# EAGLE design USBug (EAGLE 6.1)
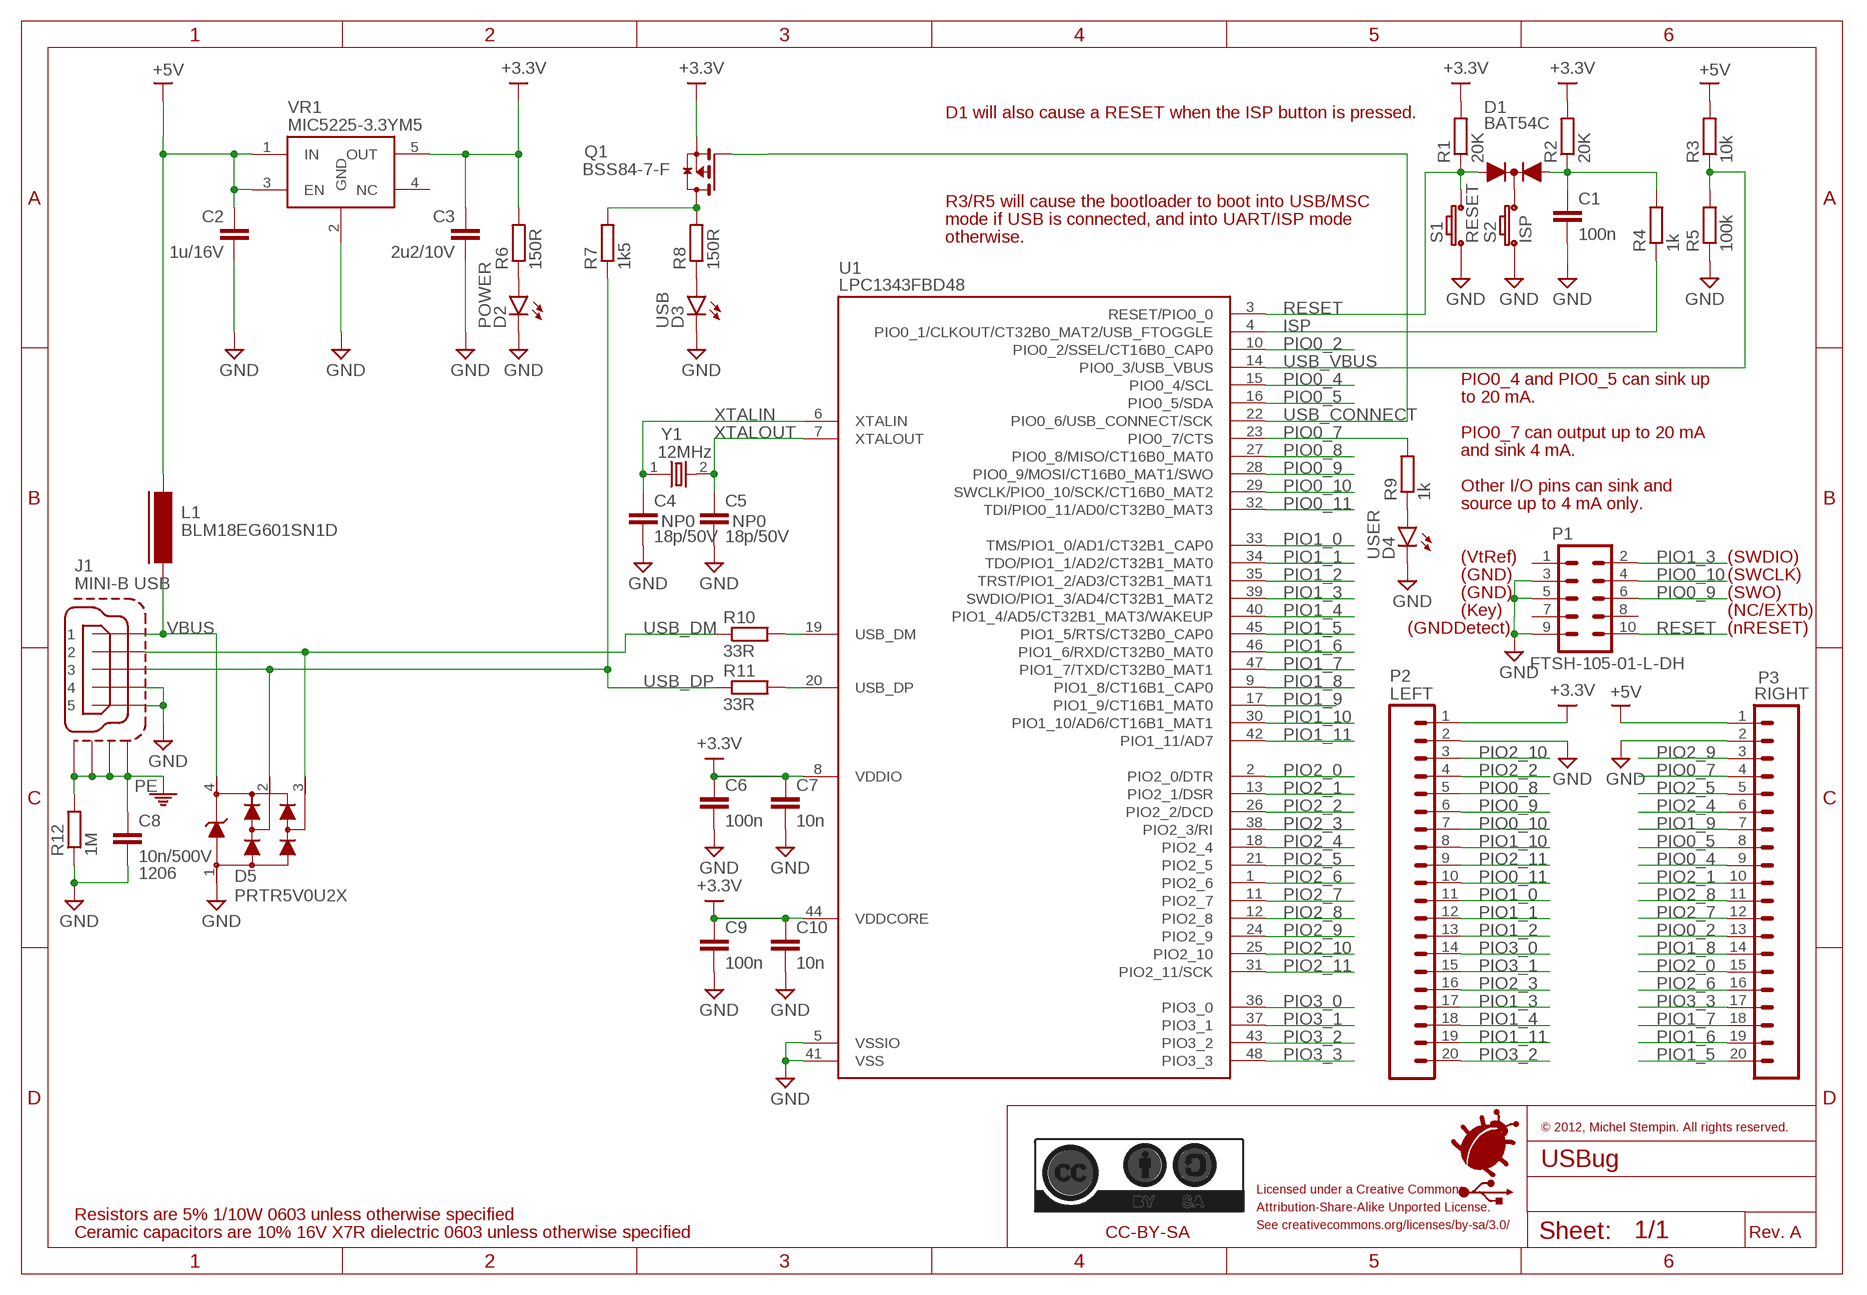
[diagram p0: schematic, sheet 1]

## Parts
C1  100n  CAP_0603  [CAP_0603]
C2  1u/16V  CAP_0603  [CAP_0603]
C3  2u2/10V  CAP_0603  [CAP_0603]
C4  18p/50V  CAP_0603  [CAP_0603]
C5  18p/50V  CAP_0603  [CAP_0603]
C6  100n  CAP_0603  [CAP_0603]
C7  10n  CAP_0603  [CAP_0603]
C8  10n/500V  CAP_1206  [CAP_1206]
C9  100n  CAP_0603  [CAP_0603]
C10  10n  CAP_0603  [CAP_0603]
D1  BAT54C  [SOT23-R]
D2  POWER  LED_0805  [LED_0805]
D3  USB  LED_0805  [LED_0805]
D4  USER  LED_0805  [LED_0805]
D5  PRTR5V0U2X  [SOT143B]
J1  MINI-B USB  MINI-B_USBUX60-MB-5ST  [UX60-MB-5ST]
L1  BLM18EG601SN1D  FERRITE_BEAD0603  [FB_0603]
LOGO  USBUG  [USBUG]
P1  FTSH-105-01-L-DH  [FTSH-105-01-L-DH]
P2  LEFT  HEADER_1X20_LOCK  [SPARKFUN_1X20_LOCK]
P3  RIGHT  HEADER_1X20_LOCK  [SPARKFUN_1X20_LOCK]
Q1  BSS84-7-F  [SOT23-R]
R1  20K  RES_0603  [RES_0603]
R2  20K  RES_0603  [RES_0603]
R3  10k  RES_0603  [RES_0603]
R4  1k  RES_0603  [RES_0603]
R5  100k  RES_0603  [RES_0603]
R6  150R  RES_0603  [RES_0603]
R7  1k5  RES_0603  [RES_0603]
R8  150R  RES_0603  [RES_0603]
R9  1k  RES_0603  [RES_0603]
R10  33R  RES_0603  [RES_0603]
R11  33R  RES_0603  [RES_0603]
R12  1M  RES_0603  [RES_0603]
S1  RESET  SPST_SWITCH  [ADTSM3]
S2  ISP  SPST_SWITCH  [ADTSM3]
U1  LPC1343FBD48  [LQFP48]
VR1  MIC5225-3.3YM5  [SOT23-5]
Y1  12MHz  CRYSTAL_50X32  [NX5032GA]

## Nets
+3.3V: C3.1 C6.1 C7.1 C9.1 C10.1 P2.1 Q1.2(S) R1.2 R2.2 R6.2 U1.8(VDDIO) U1.44(VDDCORE) VR1.5(OUT)
+5V: C2.1 L1.1 P3.1 R3.2 VR1.1(IN) VR1.3(EN)
GND: C1.2 C2.2 C3.2 C4.2 C5.2 C6.2 C7.2 C8.2 C9.2 C10.2 D2.C D3.C D4.C D5.1 J1.4 J1.5 P1.3 P1.5 P1.9 P2.2 P3.2 R5.1 R12.1 S1.2 S2.2 U1.5(VSSIO) U1.41(VSS) VR1.2(GND)
ISP: R4.1 U1.4(PIO0_1/CLKOUT/CT32B0_MAT2/USB_FTOGGLE)
N$1: D1.3(C) S2.1
N$2: C1.1 D1.2(A2) R2.1 R4.2
N$3: D2.A R6.1
N$4: D4.A R9.1
N$9: D3.A R8.1
N$13: Q1.3(D) R7.2 R8.2
PE: C8.1 J1.M1 J1.M2 J1.M3 J1.M4 R12.2
PIO0_2: P3.13 U1.10(PIO0_2/SSEL/CT16B0_CAP0)
PIO0_4: P3.9 U1.15(PIO0_4/SCL)
PIO0_5: P3.8 U1.16(PIO0_5/SDA)
PIO0_7: P3.4 R9.2 U1.23(PIO0_7/CTS)
PIO0_8: P2.5 U1.27(PIO0_8/MISO/CT16B0_MAT0)
PIO0_9: P1.6 P2.6 U1.28(PIO0_9/MOSI/CT16B0_MAT1/SWO)
PIO0_10: P1.4 P2.7 U1.29(SWCLK/PIO0_10/SCK/CT16B0_MAT2)
PIO0_11: P2.10 U1.32(TDI/PIO0_11/AD0/CT32B0_MAT3)
PIO1_0: P2.11 U1.33(TMS/PIO1_0/AD1/CT32B1_CAP0)
PIO1_1: P2.12 U1.34(TDO/PIO1_1/AD2/CT32B1_MAT0)
PIO1_2: P2.13 U1.35(TRST/PIO1_2/AD3/CT32B1_MAT1)
PIO1_3: P1.2 P2.17 U1.39(SWDIO/PIO1_3/AD4/CT32B1_MAT2)
PIO1_4: P2.18 U1.40(PIO1_4/AD5/CT32B1_MAT3/WAKEUP)
PIO1_5: P3.20 U1.45(PIO1_5/RTS/CT32B0_CAP0)
PIO1_6: P3.19 U1.46(PIO1_6/RXD/CT32B0_MAT0)
PIO1_7: P3.18 U1.47(PIO1_7/TXD/CT32B0_MAT1)
PIO1_8: P3.14 U1.9(PIO1_8/CT16B1_CAP0)
PIO1_9: P3.7 U1.17(PIO1_9/CT16B1_MAT0)
PIO1_10: P2.8 U1.30(PIO1_10/AD6/CT16B1_MAT1)
PIO1_11: P2.19 U1.42(PIO1_11/AD7)
PIO2_0: P3.15 U1.2(PIO2_0/DTR)
PIO2_1: P3.10 U1.13(PIO2_1/DSR)
PIO2_2: P2.4 U1.26(PIO2_2/DCD)
PIO2_3: P2.16 U1.38(PIO2_3/RI)
PIO2_4: P3.6 U1.18(PIO2_4)
PIO2_5: P3.5 U1.21(PIO2_5)
PIO2_6: P3.16 U1.1(PIO2_6)
PIO2_7: P3.12 U1.11(PIO2_7)
PIO2_8: P3.11 U1.12(PIO2_8)
PIO2_9: P3.3 U1.24(PIO2_9)
PIO2_10: P2.3 U1.25(PIO2_10)
PIO2_11: P2.9 U1.31(PIO2_11/SCK)
PIO3_0: P2.14 U1.36(PIO3_0)
PIO3_1: P2.15 U1.37(PIO3_1)
PIO3_2: P2.20 U1.43(PIO3_2)
PIO3_3: P3.17 U1.48(PIO3_3)
RESET: D1.1(A1) P1.10 R1.1 S1.1 U1.3(RESET/PIO0_0)
USB_CONNECT: Q1.1(G) U1.22(PIO0_6/USB_CONNECT/SCK)
USB_DM: D5.3 J1.2 R10.1
USB_DP: D5.2 J1.3 R7.1 R11.1
USB_VBUS: R3.1 R5.2 U1.14(PIO0_3/USB_VBUS)
USBD+: R10.2 U1.19(USB_DM)
USBD-: R11.2 U1.20(USB_DP)
VBUS: D5.4 J1.1 L1.2
XTALIN: C4.1 U1.6(XTALIN) Y1.1
XTALOUT: C5.1 U1.7(XTALOUT) Y1.2
Unconnected: P1.1 P1.7 P1.8 VR1.4(NC)

## Notes on the sheet
- D1 will also cause a RESET when the ISP button is pressed.
- R3/R5 will cause the bootloader to boot into USB/MSC
- mode if USB is connected, and into UART/ISP mode
- otherwise.
- PIO0_4 and PIO0_5 can sink up
- to 20 mA.
- PIO0_7 can output up to 20 mA
- and sink 4 mA.
- Other I/O pins can sink and
- source up to 4 mA only.
- (VtRef) | (SWDIO)
- (GND) | (SWCLK)
- (GND) | (SWO)
- (Key) | (NC/EXTb)
- (GNDDetect) | (nRESET)
- © 2012, Michel Stempin. All rights reserved.
- Licensed under a Creative Commons
- Attribution-Share-Alike Unported License.
- Resistors are 5% 1/10W 0603 unless otherwise specified
- See creativecommons.org/licenses/by-sa/3.0/
- Ceramic capacitors are 10% 16V X7R dielectric 0603 unless otherwise specified | CC-BY-SA | Rev. A

## Library data of the parts
C1-C3 C6 C7 C9 C10 = USBug:CAP
C4 C5 = USBug:CAP; DIELECTRIC: NP0
C8 = USBug:CAP; FOOTPRINT: 1206
D1 = USBug:BAT54C: BAT54C Schottky Diodes (Common Cathode) 30V 200mA, SOT-23 Package Digikey: BAT54CFSCT-ND
D2-D4 = USBug:LED
D5 = USBug:PRTR5V0U2X: Ultra low capacitance double rail-to-rail ESD protection diode
J1 = USBug:MINI-B_USB: MINI USB Connector Source: http://www.hirose.co.jp/cataloge_hp/e24000019.pdf
L1 = USBug:FERRITE_BEAD
LOGO = USBug:USBUG
P1 = USBug:FTSH-105-01-L-DH: Header 10 Position Dual Row 0.5" Pitch Right Angle
P2 P3 = USBug:HEADER_1X20: This is just like the LOCK variant in that the holes are staggared by 5 mil, but except for the last two holes. They are not altered from the "standard" footprint layout. This is used for a special purpose on the layout of our Graphic LCD Backpack. Make sure you want to use this device before selecting it for you project!
Q1 = USBug:BSS84: P-Channel Enhancement Mode Field Effect Transistor Source: http://www.diodes.com/datasheets/ds30149.pdf
R1-R12 = USBug:RES
S1 S2 = USBug:SPST_SWITCH: 3.5 x 6 mm Vertical Tact Switch Source: ADTS3.pdf ADTSM32RVTR 260gf operating force, 5 mm height (Red): [Digikey: 679-2307-1-ND]
U1 = USBug:LPC1343FBD48: LPC1343FBD48 72 MHz 32-bit ARM Cortex-M3 microcontroller. 32 kB Flash, 8 kB SRAM, USB Device in LQFP48 package Mouser: 771-LPC1343FBD48151 <http://www2.mouser.com/search/ProductDetail.aspx?qs=GXxaSVPoQQrV0FOIhs3F%252bQ%3d%3d> Digikey: 568-4945-ND <http://search.digikey.com/us/en/products/LPC1343FBD48,151/568-4945-ND/2180456>
VR1 = USBug:MIC5225: Ultra-Low Quiescent Current 150mA µCap Low Dropout Regulator; VOLTAGE: 3.3V
Y1 = USBug:CRYSTAL

## Board
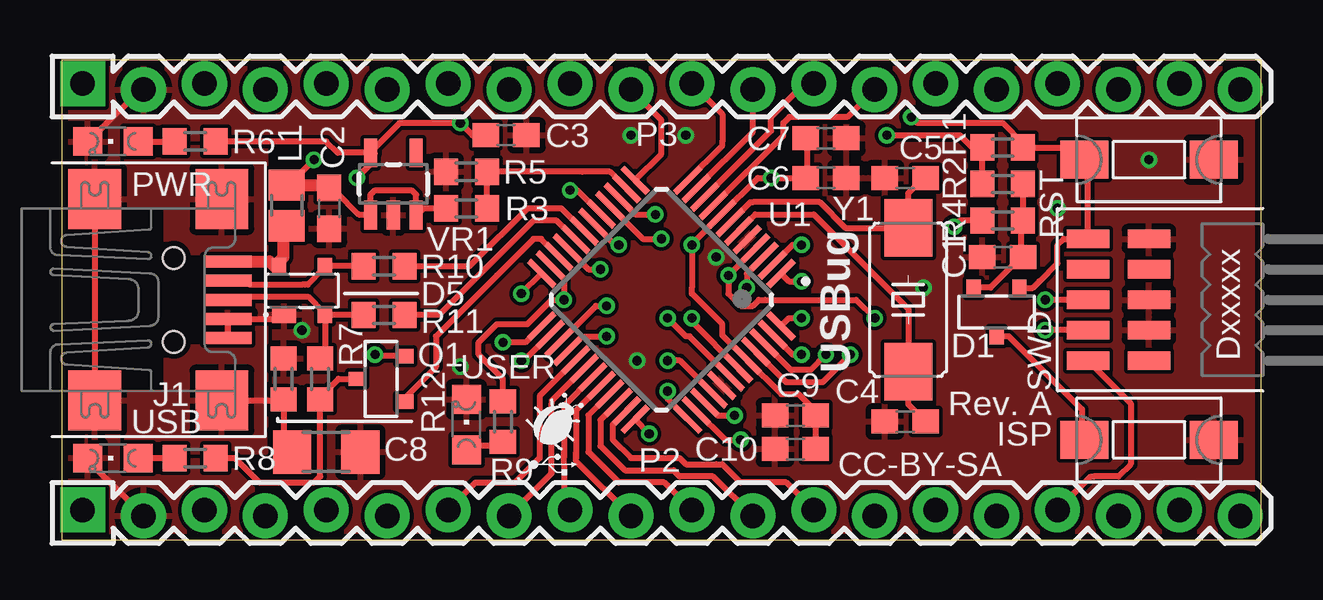
[diagram p1: board, top side]
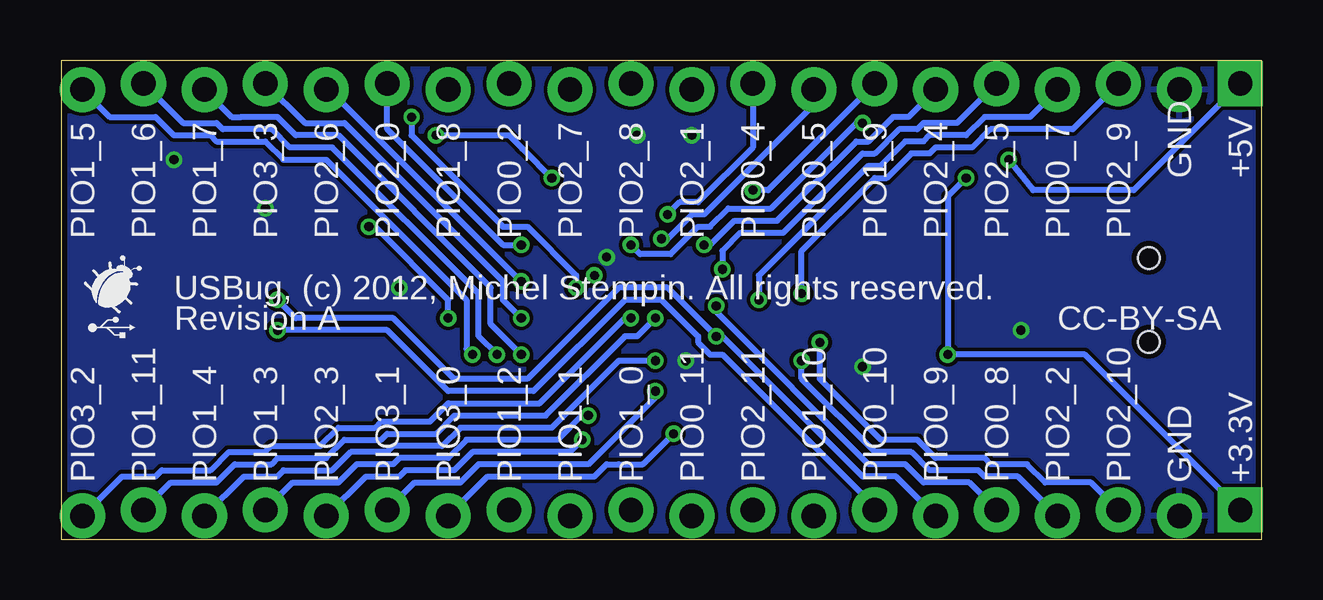
[diagram p2: board, bottom side, seen from below]

Size 50 x 20 mm. Coordinates in mm from the lower left corner, seen from the top.
Outline: 0,0 50,0 50,20 0,20 0,0
Copper layers (1*16): Top 0.035mm / dielectric 1.5mm / Bottom 0.035mm
Design rules: minimum track width 6mil, minimum drill 12mil, track to track 6mil, track to pad 6mil, pad to pad 6mil, via to via 6mil, smd to smd 0mil, copper to edge 10mil, drill to drill 10mil, minimum pad ring 10mil, minimum via ring 6mil, stop-mask expansion 2mil, vias tented up to drill 100mil, thermal gap 10mil

### Footprints (pad centres in the part's own frame; a part is rotated, then mirrored left to right if it is on the bottom)
CAP_0603 = smd 1.1 x 1: 1 -0.85,0; 2 0.85,0
CAP_1206 = smd 1.6 x 1.803: 1 -1.422,0; 2 1.422,0
SOT23-R = smd 0.6 x 0.7: 1 -0.95,-1; 2 0.95,-1; 3 0,1
LED_0805 = smd 1.2 x 1.2: A 0,-1.05; C 0,1.05
SOT143B = smd 1 x 0.7: 1 -0.75,-1 | smd 0.6 x 0.7: 2 0.95,-1; 3 0.95,1; 4 -0.95,1
UX60-MB-5ST = smd 2 x 0.5: 1 2.25,1.6; 2 2.25,0.8; 3 2.25,0; 4 2.25,-0.8; 5 2.25,-1.6 | smd 2.2 x 2.5: M1 -3.3,-4.2; M2 -3.3,4.2; M3 2,4.2; M4 2,-4.2 | hole 0.9: 0,-1.75; 0,1.75
FB_0603 = smd 1.3 x 1.5: 1 -0.85,0; 2 0.85,0
FTSH-105-01-L-DH = smd 0.762 x 1.778: 1 -2.54,-1.27; 2 -2.54,1.27; 3 -1.27,-1.27; 4 -1.27,1.27; 5 0,-1.27; 6 0,1.27; 7 1.27,-1.27; 8 1.27,1.27; 9 2.54,-1.27; 10 2.54,1.27
SPARKFUN_1X20_LOCK = drill 1.016 pad 1.88 square: 1 0,0.127 | drill 1.016 pad 1.88: 2 2.54,-0.127; 3 5.08,0.127; 4 7.62,-0.127; 5 10.16,0.127; 6 12.7,-0.127; 7 15.24,0.127; 8 17.78,-0.127; 9 20.32,0.127; 10 22.86,-0.127; 11 25.4,0.127; 12 27.94,-0.127; 13 30.48,0.127; 14 33.02,-0.127; 15 35.56,0.127; 16 38.1,-0.127; 17 40.64,0.127; 18 43.18,-0.127; 19 45.72,0.127; 20 48.26,-0.127
RES_0603 = smd 1 x 1.1: 1 -0.85,0; 2 0.85,0
ADTSM3 = smd 2 x 1.6: 1 -2.7,0; 2 2.7,0
LQFP48 = smd 1.5 x 0.25: 1 -4.3,2.75; 2 -4.3,2.25; 3 -4.3,1.75; 4 -4.3,1.25; 5 -4.3,0.75; 6 -4.3,0.25; 7 -4.3,-0.25; 8 -4.3,-0.75; 9 -4.3,-1.25; 10 -4.3,-1.75; 11 -4.3,-2.25; 12 -4.3,-2.75; 25 4.3,-2.75; 26 4.3,-2.25; 27 4.3,-1.75; 28 4.3,-1.25; 29 4.3,-0.75; 30 4.3,-0.25; 31 4.3,0.25; 32 4.3,0.75; 33 4.3,1.25; 34 4.3,1.75; 35 4.3,2.25; 36 4.3,2.75 | smd 0.25 x 1.5: 13 -2.75,-4.3; 14 -2.25,-4.3; 15 -1.75,-4.3; 16 -1.25,-4.3; 17 -0.75,-4.3; 18 -0.25,-4.3; 19 0.25,-4.3; 20 0.75,-4.3; 21 1.25,-4.3; 22 1.75,-4.3; 23 2.25,-4.3; 24 2.75,-4.3; 37 2.75,4.3; 38 2.25,4.3; 39 1.75,4.3; 40 1.25,4.3; 41 0.75,4.3; 42 0.25,4.3; 43 -0.25,4.3; 44 -0.75,4.3; 45 -1.25,4.3; 46 -1.75,4.3; 47 -2.25,4.3; 48 -2.75,4.3
SOT23-5 = smd 0.55 x 1.2: 1 -0.95,-1.3; 2 0,-1.3; 3 0.95,-1.3; 4 0.95,1.3; 5 -0.95,1.3
NX5032GA = smd 2.4 x 2: 1 -3,0; 2 3,0

### Placement (x,y rotation side)
C1  39.22,11.78 180 top
C2  11.16,13.81 270 top
C3  18.52,16.86 0 top
C4  35.16,4.92 180 top
C5  35.16,15.08 180 top
C6  31.86,15.08 0 top
C7  31.86,16.73 0 top
C8  11.03,3.65 0 top
C9  30.59,5.17 180 top
C10  30.59,3.78 180 top
D1  38.97,9.49 180 top
D2  2.14,16.6 90 top
D3  2.14,3.4 90 top
D4  16.87,4.79 0 top
D5  10.01,10.38 0 top
J1  4.68,10 0 top
L1  9.38,13.94 270 top
LOGO  -2.94,-14.13 0 top  (outside the outline)
P1  44.05,10 90 top
P2  0.87,1.11 0 top
P3  0.87,18.89 0 top
Q1  13.32,6.7 90 top
R1  39.22,16.35 180 top
R2  39.22,14.83 180 top
R3  16.87,13.81 180 top
R4  39.22,13.3 0 top
R5  16.87,15.33 0 top
R6  5.57,16.6 0 top
R7  10.78,6.7 270 top
R8  5.57,3.4 0 top
R9  18.4,4.92 90 top
R10  13.44,11.4 0 top
R11  13.44,9.37 0 top
R12  9.25,6.7 270 top
S1  45.32,15.84 0 top
S2  45.32,4.16 0 top
U1  25,10 225 top
VR1  13.82,14.83 0 top
Y1  35.29,10 90 top

### Tracks (layer width: path | path; a pad name or v marks a point on that pad's centre or on a via)
+3.3V  (via drill 0.38)
  Top 0.254: VR1.5 11.51,16.13 11.03,16.6 6.46,16.6 | 31.1,16.6 31.1,15.08 C6.1 v29.57,15.08 29.02,15.08 U1.8 26.27,12.33 v26.27,12.29 26.27,10.51 26.27,10.25 27.54,8.98 27.54,8.52 U1.44 30,6.06 30.71,6.06 31.35,5.43 31.35,5.17 C9.1 C10.1 | 12.81,16.1 14.08,17.37 v16.62,17.37 17.13,16.86 C3.1 | Q1.2 13.13,7.65 v13.06,7.71 | v34.4,16.86 37.45,16.86 37.95,16.35 R1.2 R2.2 | 12.81,16.1 13.06,16.1 | 12.81,16.1 12.81,15.59 v12.3,15.08
  Top 0.406: 6.46,16.6 R6.2 | VR1.5 12.87,16.1 12.81,16.1 | C7.1 31.1,16.73 31.1,16.6 | 31.1,15.08 C6.1
  Bottom 0.254: v26.27,12.29 25.89,11.9 24.62,11.9 24.49,12.03 24.24,12.29 23.48,13.05 22.97,13.05 22.21,13.81 20.43,13.81 16.87,17.37 v16.62,17.37 | 30.84,16.35 30.71,16.22 | 30.71,16.22 v29.57,15.08 | v34.4,16.86 31.35,16.86 30.71,16.22 | v12.3,15.08 13.06,14.32 v13.06,7.71 7.35,7.71 P2.1
+5V  (via drill 0.38)
  Top 0.254: 11.03,14.79 C2.1 | R3.2 15.09,13.81 14.84,13.56 14.81,13.53 VR1.3 14.77,14.38 14.59,14.57 13.07,14.57 12.87,14.38 VR1.1 12.84,13.56 12.81,13.56 12.39,13.56 11.44,14.51 11.28,14.66 | v10.52,15.84 9.38,14.7 L1.1
  Top 0.406: C2.1 11.28,14.66 11.28,14.57
  Top 0.508: L1.1 11.03,14.79
  Bottom 0.254: v10.52,15.84 9.51,14.57 5.31,14.57 P3.1
GND  (via drill 0.38)
  Top 0.254: D5.1 9.08,9.2 J1.4 J1.5 | D3.C 1.09,3.3 P2.2 | D2.C 1.25,16.6 1.25,16.73 3.41,18.89
  other vias: 10.01,8.73 27.29,11.78 16.62,7.21 23.73,16.86 26.02,16.86 45.32,15.84 23.98,7.46 35.92,10.51 41.51,13.81
  pour Top (rank 2): -0.4,20.16 50.4,20.16 50.4,-0.16 -0.4,-0.16
  pour Bottom: -0.4,20.16 50.4,20.16 50.4,-0.16 -0.4,-0.16
ISP  (via drill 0.38)
  Top 0.254: U1.4 28.92,12.15 v27.79,11.02 27.79,10.25 28.3,9.75 28.81,9.75 29.06,10 29.32,10 33.13,10 v33.89,9.24 | 38.46,13.3 R4.1 37.45,13.3 v37.19,13.05
  Bottom 0.254: v33.89,9.24 33.89,10 36.94,13.05 v37.19,13.05
N$1
  Top 0.254: S2.1 42.53,4.16 42.53,5.43 39.48,8.48 38.97,8.48 D1.3
N$2
  Top 0.254: R2.1 40.07,13.39 | 40.07,13.39 39.99,13.3 39.99,11.87 | 40.07,13.39 R4.2 | 39.99,11.87 C1.1 | 39.99,11.87 39.99,11.78 38.72,10.51 37.95,10.51 38,10.51 D1.2
N$3
  Top 0.254: D2.A 4.68,16.6 4.68,16.35
  Top 0.406: R6.1 4.68,16.6 4.68,16.35
N$4
  Top 0.254: R9.1 18.23,3.9 16.87,3.9 D4.A
N$9
  Top 0.254: D3.A R8.1
N$13
  Top 0.254: R8.2 7.22,3.4 8.24,2.38 10.52,2.38 10.78,2.63 R7.2 10.78,5.94 11.54,6.7 12.3,6.7 Q1.3
PE
  Top 0.254: J1.M4 9.08,5.8 R12.2 9.25,4.01 C8.1 | J1.M2 1.38,5.43 0.87,4.92
  pour Top: -0.4,16.35 8.49,16.35 8.49,3.65 -0.4,3.65
PIO0_2
  Top 0.254: U1.10 29.57,17.05 29.57,17.62 30.97,19.02 P3.13
PIO0_4  (via drill 0.38)
  Top 0.254: U1.15 23.92,13.56 v24.75,13.56
  Bottom 0.254: P3.9 21.19,16.35 23.48,14.06 24.24,14.06 v24.75,13.56
PIO0_5  (via drill 0.38)
  Top 0.254: U1.16 24.23,12.54 v25,12.54
  Bottom 0.254: v25,12.54 24.75,12.54 23.73,13.56 23.22,13.56 18.65,18.13 P3.8
PIO0_7  (via drill 0.38)
  Top 0.254: R9.2 18.4,6.7 17.38,7.71 17.38,8.22 18.14,8.98 19.41,8.98 20.43,10 v20.94,10 20.94,10.88 U1.23
  Bottom 0.254: P3.4 9.63,17.62 11.54,17.62 12.3,16.86 13.82,16.86 14.08,16.6 14.84,16.6 15.86,15.59 16.36,15.59 20.94,11.02 v20.94,10
PIO0_8  (via drill 0.38)
  Top 0.254: U1.27 22.27,9.75 v22.71,9.75
  Bottom 0.254: v22.71,9.75 22.71,9.49 16.36,3.14 14.84,3.14 14.08,2.38 12.17,2.38 P2.5
PIO0_9  (via drill 0.38)
  Top 0.254: U1.28 21.71,8.48 v22.71,8.48 | P1.6 v41,10
  Bottom 0.254: P2.6 15.22,2.63 16.62,2.63 22.46,8.48 v22.71,8.48 24.75,10.51 26.78,10.51 30.59,6.7 33.64,6.7 36.18,9.24 40.24,9.24 v41,10
PIO0_10  (via drill 0.38)
  Top 0.254: U1.29 19.92,5.98 19.92,3.4 18.9,2.38 17.25,2.38 P2.7 | P1.4 v41,8.73
  Bottom 0.254: v41,8.73 36.43,8.73 33.89,6.19 30.33,6.19 26.52,10 25,10 23.48,8.48 23.48,8.22 22.97,7.71 22.46,7.71 16.11,1.36 P2.7
PIO0_11
  Top 0.254: P2.10 21.44,3.27 21.44,3.65 | U1.32 21.44,5.38 21.44,3.65 | 21.44,3.65 21.44,3.4
PIO1_0
  Top 0.254: U1.33 21.95,5.18 21.95,3.65 23.22,2.38 25.13,2.38 P2.11
PIO1_1
  Top 0.254: U1.34 22.46,4.98 22.46,3.9 23.48,2.89 25.51,2.89 25.76,2.63 27.16,2.63 P2.12
PIO1_2
  Top 0.254: U1.35 22.97,4.79 22.97,4.16 23.73,3.4 25.76,3.4 26.02,3.14 27.29,3.14 27.54,3.14 28.3,2.38 30.21,2.38 P2.13
PIO1_3  (via drill 0.38)
  Top 0.254: U1.39 27.35,5.17 v28.05,5.17 | P2.17 42.91,2.63 43.03,2.63 44.05,2.63 44.56,3.14 44.56,5.68 P1.2
  Bottom 0.254: 28.3,5.17 v28.05,5.17 28.3,5.17 | 28.3,5.17 29.32,4.16 33.13,4.16 33.89,3.4 35.92,3.4 36.18,3.14 37.7,3.14 38.46,2.38 40.37,2.38 P2.17
PIO1_4  (via drill 0.38)
  Top 0.254: U1.40 25.77,7.46 v25.25,7.46
  Bottom 0.254: P2.18 42.4,2.63 41,2.63 40.75,2.89 38.72,2.89 37.95,3.65 36.43,3.65 36.18,3.9 34.14,3.9 33.38,4.67 29.57,4.67 26.78,7.46 v25.25,7.46
PIO1_5  (via drill 0.38)
  Top 0.254: U1.45 30.2,6.57 31.73,6.57 v32.87,7.71
  Bottom 0.254: P3.20 47.99,17.62 46.08,17.62 45.32,16.86 43.8,16.86 43.54,16.6 41.51,16.6 40.75,15.84 38.97,15.84 33.13,10 33.13,7.97 v32.87,7.71
PIO1_6  (via drill 0.38)
  Top 0.254: v31.86,7.71 31.22,7.08 30.71,7.08 30.59,7.08 30.46,7.08 30.4,7.08 U1.46
  Bottom 0.254: P3.19 44.94,17.37 43.54,17.37 43.29,17.11 41.26,17.11 40.49,16.35 38.72,16.35 32.62,10.25 32.62,8.48 v31.86,7.71
PIO1_7  (via drill 0.38)
  Top 0.254: U1.47 30.47,7.71 v30.84,7.71
  Bottom 0.254: v30.84,7.71 32.11,8.98 32.11,10.51 38.46,16.86 40.24,16.86 41,17.62 42.53,17.62 42.91,17.62 P3.18
PIO1_8
  Top 0.254: U1.9 30.08,16.85 30.08,17.11 30.08,17.37 30.33,17.62 32.75,17.62 P3.14
PIO1_9  (via drill 0.38)
  Top 0.254: U1.17 21.49,14.57 v21.19,14.57
  Bottom 0.254: P3.7 20.55,14.57 v21.19,14.57
PIO1_10
  Top 0.254: P2.8 20.43,2.76 20.43,5.68 20.43,5.78 U1.30
PIO1_11  (via drill 0.38)
  Top 0.254: U1.42 26.17,8.48 26.02,8.48 25.51,8.98 v25.25,9.24
  Bottom 0.254: P2.19 45.45,2.38 43.54,2.38 42.78,3.14 41.26,3.14 41,3.4 38.97,3.4 38.21,4.16 36.68,4.16 36.43,4.41 34.4,4.41 33.64,5.17 29.83,5.17 26.52,8.48 26.02,8.48 v25.25,9.24
PIO2_0  (via drill 0.38)
  Top 0.254: U1.2 30.47,12.29 v30.84,12.29
  Bottom 0.254: P3.15 36.43,17.11 32.11,12.79 31.6,12.29 v30.84,12.29
PIO2_1
  Top 0.254: P3.10 25,17.49 25,16.08 U1.13
PIO2_2  (via drill 0.38)
  Top 0.254: U1.26 19.28,7.46 v19.16,7.46
  Bottom 0.254: v19.16,7.46 19.16,6.7 16.11,3.65 14.59,3.65 13.82,2.89 11.79,2.89 11.54,2.63 10.14,2.63 P2.4
PIO2_3  (via drill 0.38)
  Top 0.254: U1.38 27.66,4.16 v28.3,4.16
  Bottom 0.254: v28.3,4.16 28.81,3.65 32.87,3.65 33.64,2.89 35.67,2.89 35.92,2.63 37.32,2.63 P2.16
PIO2_4  (via drill 0.38)
  Top 0.254: U1.18 23.07,12.29 v23.22,12.29
  Bottom 0.254: P3.6 14.71,17.62 15.35,17.62 16.36,16.6 16.87,16.6 20.17,13.3 21.95,13.3 22.97,12.29 v23.22,12.29
PIO2_5  (via drill 0.38)
  Top 0.254: U1.21 21.96,11.27 v22.46,11.27
  Bottom 0.254: P3.5 12.68,17.37 14.08,17.37 14.33,17.11 15.09,17.11 16.11,16.1 16.62,16.1 19.92,12.79 21.7,12.79 22.46,12.03 v22.46,11.27
PIO2_6  (via drill 0.38)
  Top 0.254: U1.1 30.32,10.76 v30.84,10.76
  Bottom 0.254: P3.16 38.84,18.76 v30.84,10.76
PIO2_7
  Top 0.254: U1.11 28.81,16.99 P3.12
PIO2_8
  Top 0.254: P3.11 27.54,17.75 27.54,16.6 27.54,16.43 U1.12
PIO2_9  (via drill 0.38)
  Top 0.254: v19.16,10.25 U1.24
  Bottom 0.254: P3.3 7.86,17.11 11.28,17.11 12.05,16.35 13.57,16.35 13.82,16.1 14.59,16.1 15.6,15.08 16.11,15.08 19.16,12.03 v19.16,10.25
PIO2_10  (via drill 0.38)
  Top 0.254: U1.25 19.33,8.22 v18.4,8.22
  Bottom 0.254: v18.4,8.22 18.4,6.7 15.86,4.16 14.33,4.16 13.57,3.4 11.54,3.4 11.28,3.14 9.76,3.14 9,2.38 7.09,2.38 P2.3
PIO2_11
  Top 0.254: U1.31 20.94,5.58 20.94,3.65 | 20.94,3.65 20.94,3.4 | 20.94,3.65 20.94,3.14 20.94,1.87 20.94,1.49 P2.9
PIO3_0  (via drill 0.38)
  Top 0.254: v24.49,4.41 U1.36
  Bottom 0.254: P2.14 32.24,2.63 27.79,2.63 27.29,3.14 26.78,3.14 25.76,3.14 v24.49,4.41
PIO3_1  (via drill 0.38)
  Top 0.254: U1.37 25.25,5.86 v25.25,6.19
  Bottom 0.254: P2.15 35.29,2.38 33.38,2.38 32.62,3.14 28.05,3.14 25.25,5.94 v25.25,6.19
PIO3_2  (via drill 0.38)
  Top 0.254: U1.43 26.27,9.08 v26.27,9.24
  Bottom 0.254: P2.20 47.48,2.63 46.08,2.63 45.83,2.89 43.8,2.89 43.03,3.65 41.51,3.65 41.26,3.9 39.22,3.9 38.46,4.67 36.94,4.67 36.68,4.92 34.65,4.92 33.89,5.68 30.08,5.68 26.65,9.11 | 26.65,9.11 26.52,9.24 | v26.27,9.24 26.52,9.24 | 26.52,9.24 26.65,9.11
PIO3_3  (via drill 0.38)
  Top 0.254: U1.48 30.32,9.24 v30.84,9.24
  Bottom 0.254: v30.84,9.24 31.6,10 31.6,10.76 38.21,17.37 39.86,17.37 P3.17
RESET  (via drill 0.38)
  Top 0.254: U1.3 28.56,11.08 v28.56,10.51 | v35.41,17.62 35.67,17.37 39.22,17.37 40.07,16.52 R1.1 41.76,16.35 42.53,15.59 42.62,15.68 42.62,15.75 42.53,15.84 S1.1 42.78,15.68 P1.10 41.76,12.54 41.51,12.29 41.51,11.52 40.75,10.76 40.48,10.49 D1.1
  Bottom 0.254: v35.41,17.62 35.41,16.86 31.6,13.05 30.59,13.05 28.56,11.02 v28.56,10.51
USB_CONNECT
  Top 0.254: U1.22 19.99,12.54 19.67,12.54 18.14,11.02 15.6,8.48 15.6,7.21 14.33,5.94 14.33,5.76 Q1.1
USB_DM
  Top 0.254: R10.1 10.98,11.4 D5.3 10.89,11.38 10.89,11.25 10.27,10.63 10.14,10.63 10.01,10.63 7.86,10.63 7.69,10.8 J1.2
USB_DP
  Top 0.254: R11.1 10.98,9.37 | 10.98,9.37 D5.2 10.96,9.43 10.27,10.13 7.86,10.13 7.73,10 J1.3 | 10.98,9.37 10.98,7.75 R7.1
USB_VBUS
  Top 0.254: U1.14 22.85,15.33 21.7,15.33 R5.2 R3.1
USBD+
  Top 0.254: U1.19 20.84,13.81 19.67,13.81 19.41,13.81 17.13,11.52 17,11.4 R10.2
USBD-
  Top 0.254: U1.20 20.64,13.3 19.67,13.3 15.73,9.37 R11.2
VBUS
  Top 0.406: 9.25,13.05 9.38,13.05 L1.2
  Top 0.508: J1.1 8.67,11.6 9,11.27 9,11.52 | 9,11.52 9.25,11.78 9.25,13.05 | D5.4 9.06,11.46 9,11.52
XTALIN
  Top 0.254: U1.6 28.91,13.56 31.35,13.56 35.29,9.62 Y1.1 35.29,5.64 C4.1
XTALOUT
  Top 0.254: U1.7 28.71,14.06 28.81,14.06 31.6,14.06 32.67,13 Y1.2 35.29,14.45 35.92,15.08
  Top 0.406: 35.92,15.08 C5.1

### Text on the board
tPlace: PWR | RST | Dxxxxx | USER | USBug | SWD | USB | Rev. A | ISP | CC-BY-SA
bPlace: USBug, (c) 2012, Michel Stempin. All rights reserved. | CC-BY-SA | Revision A
bNames: +5V | GND | PIO2_9 | PIO0_7 | PIO2_5 | PIO2_4 | PIO1_9 | PIO0_5 | PIO0_4 | PIO2_1 | PIO2_8 | PIO2_7 | PIO0_2 | PIO1_8 | PIO2_0 | PIO2_6 | PIO3_3 | PIO1_7 | PIO1_6 | PIO1_5 | +3.3V | GND | PIO2_10 | PIO2_2 | PIO0_8 | PIO0_9 | PIO0_10 | PIO1_10 | PIO2_11 | PIO0_11 | PIO1_0 | PIO1_1 | PIO1_2 | PIO3_0 | PIO3_1 | PIO2_3 | PIO1_3 | PIO1_4 | PIO1_11 | PIO3_2
Black: © 2012, Michel Stempin. All rights reserved. | Licensed under a Creative Commons | Attribution-Share-Alike Unported License. | See creativecommons.org/licenses/by-sa/3.0/ | CC-BY-SA